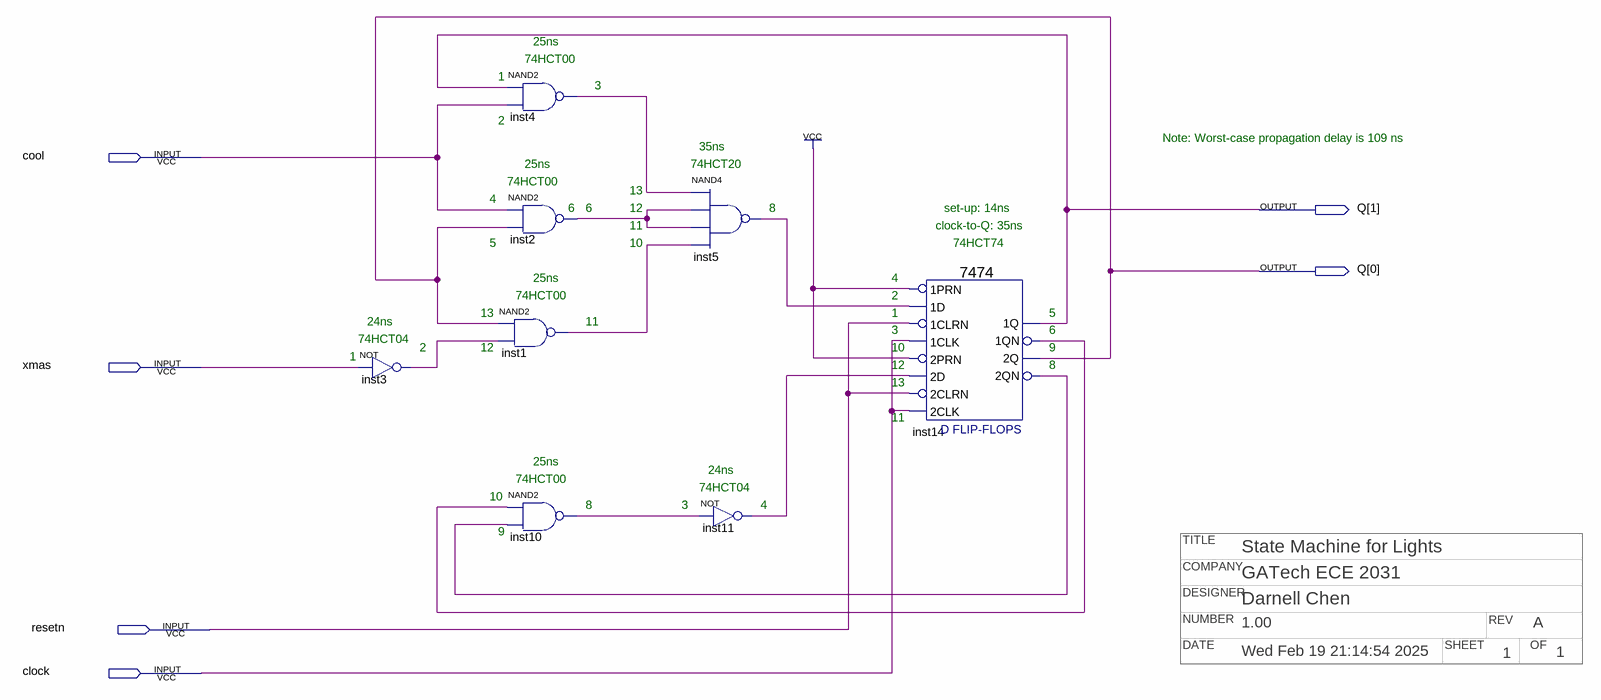
[diagram p0: schematic sheet]
// Quartus schematic Lab4Circuit.bdf as structural Verilog: 8 symbols, 6 pins
// Title block: COMPANY: GATech ECE 2031; DATE: Wed Feb 19 21:14:54 2025; DESIGNER: Darnell Chen; NUMBER: 1.00; OF: 1; REV: A; SHEET: 1; TITLE: State Machine for Lights
module Lab4Circuit (
  input  cool,
  input  xmas,
  input  resetn,
  input  clock,
  output [1:0] Q
);

  wire inst1_out, inst2_out, inst3_out, inst4_out, inst5_out, inst10_out, inst11_out, inst14_1qn, inst14_2qn;

  not inst3 (inst3_out, xmas);
  nand inst4 (inst4_out, Q[1], cool);
  nand inst2 (inst2_out, cool, Q[0]);
  nand inst1 (inst1_out, Q[0], inst3_out);
  nand inst10 (inst10_out, inst14_1qn, inst14_2qn);
  nand inst5 (inst5_out, inst4_out, inst2_out, inst2_out, inst1_out);
  not inst11 (inst11_out, inst10_out);
  \7474  inst14 (
    .\2D (inst11_out), .\2PRN (1'b1), .\1CLK (clock), .\1D (inst5_out), .\1PRN (1'b1), .\2CLK (clock),
    .\2CLRN (resetn), .\1CLRN (resetn), .\1QN (inst14_1qn), .\2Q (Q[0]), .\2QN (inst14_2qn), .\1Q (Q[1]));

  // Notes on the sheet:
  //   25ns
  //   74HCT00
  //   1
  //   3
  //   2
  //   Note: Worst-case propagation delay is 109 ns
  //   35ns
  //   25ns
  //   74HCT20
  //   74HCT00
  //   13
  //   4
  //   6
  //   6
  //   12
  //   8
  //   set-up: 14ns
  //   11
  //   clock-to-Q: 35ns
  //   5
  //   10
  //   74HCT74
  //   25ns
  //   4
  //   74HCT00
  //   2
  //   13
  //   1
  //   5
  //   24ns
  //   11
  //   3
  //   6
  //   74HCT04
  //   2
  //   12
  //   10
  //   9
  //   1
  //   12
  //   8
  //   13
  //   11
  //   25ns
  //   24ns
  //   74HCT00
  //   74HCT04
  //   10
  //   8
  //   3
  //   4
  //   9
endmodule
